# Altium project EX384.PrjPcb
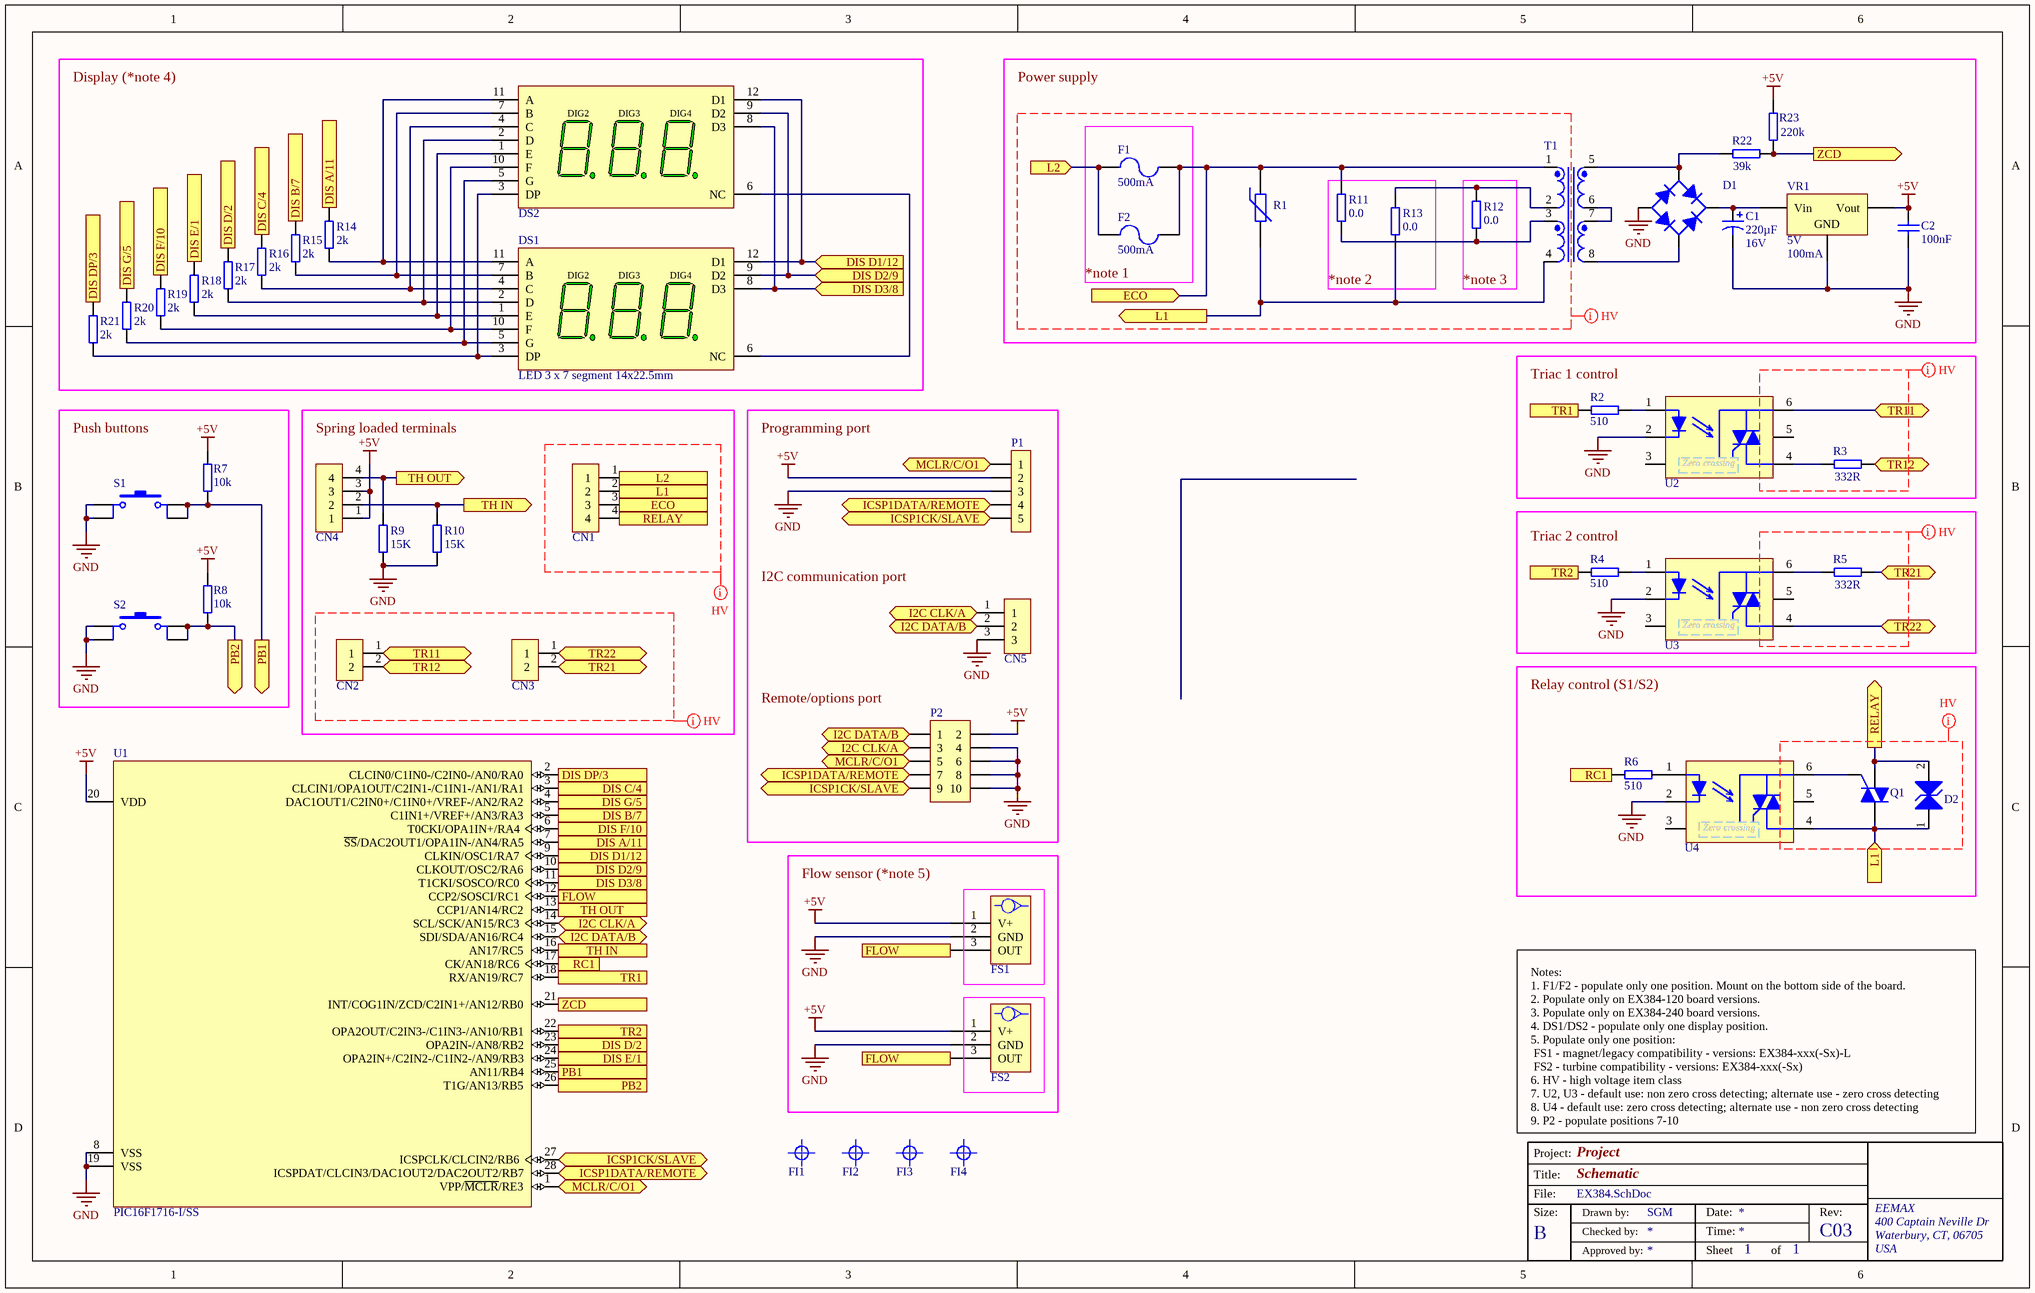
[diagram p0: EX384.SchDoc]
2 sheets, 53 parts. Net scope: flat (ports and power ports of the same name join across sheets).
Board files: EX384.PcbDoc, EX384Panel.PcbDoc
Sheets:
  EX384.SchDoc
  Sheet1.SchDoc

## Sheet EX384.SchDoc: Schematic
size B; CompanyName: EEMAX; DrawnBy: SGM; Organization: EEMAX/RHEEM; Address1: 400 Captain Neville Dr; Address2: Waterbury, CT, 06705; Address3: USA; Revision: C03; SheetNumber: 1; SheetTotal: 1; PageSetup: Record=PageOptions|CenterHorizontal=True|CenterVertical=True|PrintScale=1.00|XCorrection=1.00|YCorrection=1.00|PrintKind=1|BorderSize=5000000|LeftOffset=0|BottomOffset=0|Orientation=2|PaperLength=1000|PaperWidth=1000|Scale=100|PaperSource=7|PrintQuality=-3|MediaType=1|DitherType=10|PrintScaleMode=0|PaperKind=Ledger (11 x 17)|PaperIndex=3; ProjectName: Project

### Parts
C1  Capacitance: 220µF  Voltage Rating: 16V  [R6.3x7.7 SMD]  (hidden comment: CAP ALUM 220UF 20% 16V SMD)
C2  Capacitance: 100nF  [0805 C]  (hidden comment: CAP CER 100nF 25V NP0 0805)
CN1  TERM BLOCK PCB 4POS 3.5MM 300V 2A  [250A-4P (1212)]  (value not drawn)
CN2  TERM BLOCK PCB 2POS 3.5MM 300V 2A  [250A-2P (12)]  (value not drawn)
CN3  TERM BLOCK PCB 2POS 3.5MM 300V 2A  [250A-2P (12)]  (value not drawn)
CN4  TERM BLOCK PCB 4POS 3.5MM 300V 2A  [250A-4P (1212)]  (value not drawn)
CN5  3 Positions Header, Unshrouded Connector 0.100" (2.54mm) Through Hole Tin  [640456-3]  (value not drawn)
D1  IC BRIDGE DIODE 1A 600V 4SMD  [4 SMD]  (value not drawn)
D2  TVS DIODE 495VWM 760VC SMD  [DO-214AA (SMB)]  (value not drawn)
DS1  LED 3 x 7 segment 14x22.5mm  [LED3x7 - 10]
DS2  7-Segment LED Display, InfoVue, Red, 10 mA, 1.7 V, 6 mcd, 3, 7.1 mm  [LED3x7 - 7]  (value not drawn)
F1  Current Rating: 500mA  [FUSE X2]  (hidden comment: FUSE 500MA 250VAC 125VDC SMT)
F2  Current Rating: 500mA  [FUSE THRU]  (hidden comment: FUSE GLASS 500MA 350VAC 140VDC)
FI1  FIDUCIAL40  [FIDUCIAL40mil]  (value not drawn)  (no BOM)
FI2  FIDUCIAL40  [FIDUCIAL40mil]  (value not drawn)  (no BOM)
FI3  FIDUCIAL40  [FIDUCIAL40mil]  (value not drawn)  (no BOM)
FI4  FIDUCIAL40  [FIDUCIAL40mil]  (value not drawn)  (no BOM)
FS1  IC SW HALL EFFECT 3SIP TO92  [TO-92 - FS]  (value not drawn)
FS2  IC SW HALL EFFECT 3SIP TO92  [TO-92 - FS]  (value not drawn)
P1  Header, 5-Pin, .100 in spacing  [HDR1x5]  (value not drawn)
P2  Header, 2x5-Pin, .100 in spacing  [HDR2X5]  (value not drawn)
Q1  TRIAC SENS GATE 800V 1A SOT223  [SOT223]  (value not drawn)
R1  Varistor 150VAC 400A 3225  [3225 MOV]  (value not drawn)
R2  Resistance (Ohms): 510  [0805 C]  (hidden comment: RES SMD 510R 1% 1/8W 0805)
R3  Resistance (Ohms): 332R  [1206]  (hidden comment: RES SMD 332 OHM 1% 1/4W 1206)
R4  Resistance (Ohms): 510  [0805 C]  (hidden comment: RES SMD 510R 1% 1/8W 0805)
R5  Resistance (Ohms): 332R  [1206]  (hidden comment: RES SMD 332 OHM 1% 1/4W 1206)
R6  Resistance (Ohms): 510  [0805 C]  (hidden comment: RES SMD 510R 1% 1/8W 0805)
R7  Resistance (Ohms): 10k  [0805 C]  (hidden comment: RES SMD 10K OHM 1% 1/8W 0805)
R8  Resistance (Ohms): 10k  [0805 C]  (hidden comment: RES SMD 10K OHM 1% 1/8W 0805)
R9  Resistance (Ohms): 15K  [0805 C]  (hidden comment: RES SMD 15K OHM 1% 1/8W 0805)
R10  Resistance (Ohms): 15K  [0805 C]  (hidden comment: RES SMD 15K OHM 1% 1/8W 0805)
R11  Resistance (Ohms): 0.0  [1206]  (hidden comment: RES SMD 0.0 OHM JUMPER 1/4W 1206)
R12  Resistance (Ohms): 0.0  [1206]  (hidden comment: RES SMD 0.0 OHM JUMPER 1/4W 1206)
R13  Resistance (Ohms): 0.0  [1206]  (hidden comment: RES SMD 0.0 OHM JUMPER 1/4W 1206)
R14  Resistance (Ohms): 2k  [0805 C]  (hidden comment: RES SMD 2K OHM 1% 1/8W 0805)
R15  Resistance (Ohms): 2k  [0805 C]  (hidden comment: RES SMD 2K OHM 1% 1/8W 0805)
R16  Resistance (Ohms): 2k  [0805 C]  (hidden comment: RES SMD 2K OHM 1% 1/8W 0805)
R17  Resistance (Ohms): 2k  [0805 C]  (hidden comment: RES SMD 2K OHM 1% 1/8W 0805)
R18  Resistance (Ohms): 2k  [0805 C]  (hidden comment: RES SMD 2K OHM 1% 1/8W 0805)
R19  Resistance (Ohms): 2k  [0805 C]  (hidden comment: RES SMD 2K OHM 1% 1/8W 0805)
R20  Resistance (Ohms): 2k  [0805 C]  (hidden comment: RES SMD 2K OHM 1% 1/8W 0805)
R21  Resistance (Ohms): 2k  [0805 C]  (hidden comment: RES SMD 2K OHM 1% 1/8W 0805)
R22  Resistance (Ohms): 39k  [0805 C]  (hidden comment: RES SMD 39K OHM 1% 1/8W 0805)
R23  Resistance (Ohms): 220k  [0805 C]  (hidden comment: RES SMD 220K OHM 1% 1/8W 0805)
S1  SWITCH TACTILE NO SMT 0.05A 12VDC  [SW-PB]  (value not drawn)
S2  SWITCH TACTILE NO SMT 0.05A 12VDC  [SW-PB]  (value not drawn)
T1  FS10-110-C2  [FS10-110-C2]  (value not drawn)
U1  PIC16F1716-I/SS  [SSOP-SS28_L]
U2  OPTOISOLATOR TRIAC 6SMD  [6-SMD]  (value not drawn)
U3  OPTOISOLATOR TRIAC 6SMD  [6-SMD]  (value not drawn)
U4  OPTOISOLATOR TRIAC 6SMD  [6-SMD]  (value not drawn)
VR1  IOut: 100mA  VOut: 5V  [SOT89-3]  (hidden comment: IC REG LDO 5V 0.1A SOT89-3)

### Blocks framed on the sheet
Display (*note 4): DS1 DS2 R14-R21
Power supply: C1 C2 D1 R1 R22 R23 T1 VR1
*note 1: F1 F2
*note 2: R11 R13
*note 3: R12
Triac 1 control: R2 R3 U2
Push buttons: R7 R8 S1 S2
Spring loaded terminals: CN1-CN4 R9 R10
Triac 2 control: R4 R5 U3
Relay control (S1/S2): D2 Q1 R6 U4
Flow sensor (*note 5): FS1 FS2

### Ports
DIS A/11 (in), DIS A/11 (out), DIS B/7 (in), DIS B/7 (out), DIS C/4 (in), DIS C/4 (out), DIS D1/12 (in), DIS D1/12 (out), DIS D2/9 (in), DIS D2/9 (out), DIS D3/8 (in), DIS D3/8 (out), DIS D/2 (in), DIS D/2 (out), DIS DP/3 (in), DIS DP/3 (out), DIS E/1 (in), DIS E/1 (out), DIS F/10 (in), DIS F/10 (out), DIS G/5 (in), DIS G/5 (out), ECO (in), ECO (out), FLOW (in), FLOW (out), I2C CLK/A (bidir), I2C DATA/B (bidir), ICSP1CK/SLAVE (bidir), ICSP1DATA/REMOTE (bidir), L1 (in), L1 (out), L2 (in), L2 (out), MCLR/C/O1 (bidir), PB1 (in), PB1 (out), PB2 (in), PB2 (out), RC1 (in), RC1 (out), RELAY (in), RELAY (out), TH IN (in), TH IN (out), TH OUT (in), TH OUT (out), TR1 (in), TR1 (out), TR2 (in), TR2 (out), TR11 (bidir), TR12 (bidir), TR21 (bidir), TR22 (bidir), ZCD (in), ZCD (out)

### Nets
+5V: C2.2 CN4.1 CN4.3 FS1.1(V+) FS2.1(V+) P1.2 P2.2 R7.1 R8.1 R23.2 U1.20(VDD) VR1.1(Vout)
GND: C1.2 C2.1 CN5.3 D1.2(A) FS1.2(GND) FS2.2(GND) P1.3 P2.4 P2.6 P2.8 P2.10 R9.2 R10.2 S1.3 S1.4 S2.1 S2.2 U1.8(VSS) U1.19(VSS) U2.2 U3.2 U4.2 VR1.2(GND)
NetC1_1: C1.1 D1.1(K) VR1.3(Vin)
NetCN1_1: CN1.1 F1.1 F2.1 ; port L2
NetCN1_2: CN1.2 D2.1(A) Q1.2(A2) R1.2 R13.1 T1.4(Pri2-) U4.4 ; port L1
NetCN1_3: CN1.3 F1.2 F2.2 R1.1 R11.2 T1.1(Pri1+) ; port ECO
NetCN1_4: CN1.4 D2.2(K) Q1.1(A1) ; port RELAY
NetCN2_1: CN2.1 U2.6 ; port TR11
NetCN2_2: CN2.2 R3.2 ; port TR12
NetCN3_1: CN3.1 U3.4 ; port TR22
NetCN3_2: CN3.2 R5.2 ; port TR21
NetCN4_2: CN4.2 R10.1 U1.16(AN17/RC5) ; port TH IN
NetCN4_4: CN4.4 R9.1 U1.13(CCP1/AN14/RC2) ; port TH OUT
NetCN5_1: CN5.1 P2.3 U1.14(SCL/SCK/AN15/RC3) ; port I2C CLK/A
NetCN5_2: CN5.2 P2.1 U1.15(SDI/SDA/AN16/RC4) ; port I2C DATA/B
NetD1_3: D1.3(C) R22.1 T1.5(Sec1+)
NetD1_4: D1.4(C) T1.8(Sec2-)
NetDS1_1: DS1.1(E) DS2.1(E) R18.1
NetDS1_2: DS1.2(D) DS2.2(D) R17.1
NetDS1_3: DS1.3(DP) DS2.3(DP) R21.1
NetDS1_4: DS1.4(C) DS2.4(C) R16.1
NetDS1_5: DS1.5(G) DS2.5(G) R20.1
NetDS1_6: DS1.6(NC) DS2.6(NC)
NetDS1_7: DS1.7(B) DS2.7(B) R15.1
NetDS1_8: DS1.8(D3) DS2.8(D3) U1.11(T1CKI/SOSCO/RC0) ; port DIS D3/8
NetDS1_9: DS1.9(D2) DS2.9(D2) U1.10(CLKOUT/OSC2/RA6) ; port DIS D2/9
NetDS1_10: DS1.10(F) DS2.10(F) R19.1
NetDS1_11: DS1.11(A) DS2.11(A) R14.1
NetDS1_12: DS1.12(D1) DS2.12(D1) U1.9(CLKIN/OSC1/RA7) ; port DIS D1/12
NetFS1_3: FS1.3(OUT) FS2.3(OUT) U1.12(CCP2/SOSCI/RC1) ; port FLOW
NetP1_1: P1.1 P2.5 U1.1(VPP/~{MCLR}/RE3) ; port MCLR/C/O1
NetP1_4: P1.4 P2.7 U1.28(ICSPDAT/CLCIN3/DAC1OUT2/DAC2OUT2/RB7) ; port ICSP1DATA/REMOTE
NetP1_5: P1.5 P2.9 U1.27(ICSPCLK/CLCIN2/RB6) ; port ICSP1CK/SLAVE
NetQ1_3: Q1.3(G) U4.6
NetR2_1: R2.1 U1.18(RX/AN19/RC7) ; port TR1
NetR2_2: R2.2 U2.1
NetR3_1: R3.1 U2.4
NetR4_1: R4.1 U1.22(OPA2OUT/C2IN3-/C1IN3-/AN10/RB1) ; port TR2
NetR4_2: R4.2 U3.1
NetR5_1: R5.1 U3.6
NetR6_1: R6.1 U1.17(CK/AN18/RC6) ; port RC1
NetR6_2: R6.2 U4.1
NetR7_2: R7.2 S1.1 S1.2 U1.25(AN11/RB4) ; port PB1
NetR8_2: R8.2 S2.3 S2.4 U1.26(T1G/AN13/RB5) ; port PB2
NetR11_1: R11.1 R12.1 T1.3(Pri2+)
NetR12_2: R12.2 R13.2 T1.2(Pri1-)
NetR14_2: R14.2 U1.7(~{SS}/DAC2OUT1/OPA1IN-/AN4/RA5) ; port DIS A/11
NetR15_2: R15.2 U1.5(C1IN1+/VREF+/AN3/RA3) ; port DIS B/7
NetR16_2: R16.2 U1.3(CLCIN1/OPA1OUT/C2IN1-/C1IN1-/AN1/RA1) ; port DIS C/4
NetR17_2: R17.2 U1.23(OPA2IN-/AN8/RB2) ; port DIS D/2
NetR18_2: R18.2 U1.24(OPA2IN+/C2IN2-/C1IN2-/AN9/RB3) ; port DIS E/1
NetR19_2: R19.2 U1.6(T0CKI/OPA1IN+/RA4) ; port DIS F/10
NetR20_2: R20.2 U1.4(DAC1OUT1/C2IN0+/C1IN0+/VREF-/AN2/RA2) ; port DIS G/5
NetR21_2: R21.2 U1.2(CLCIN0/C1IN0-/C2IN0-/AN0/RA0) ; port DIS DP/3
NetR22_2: R22.2 R23.1 U1.21(INT/COG1IN/ZCD/C2IN1+/AN12/RB0) ; port ZCD
NetT1_6: T1.6(Sec1-) T1.7(Sec2+)

Not connected (* = marked no-connect by the designer): U2 3 5; U3 3 5; U4 3 5

### Layout directives
net class 300Volts: (no net found under the mark)

### Notes on the sheet
- Programming port
- I2C communication port
- (near P2) Remote/options port
- Notes:
  1. F1/F2 - populate only one position. Mount on the bottom side of the board.
  2. Populate only on EX384-120 board versions.
  3. Populate only on EX384-240 board versions.
  4. DS1/DS2 - populate only one display position.
  5. Populate only one position:
  FS1 - magnet/legacy compatibility - versions: EX384-xxx(-Sx)-L
  FS2 - turbine compatibility - versions: EX384-xxx(-Sx)
  6. HV - high voltage item class
  7. U2, U3 - default use: non zero cross detecting; alternate use - zero cross detecting
  8. U4 - default use: zero cross detecting; alternate use - non zero cross detecting
  9. P2 - populate positions 7-10
- Title:
- Project:
- Size:
- File:
- B
- Drawn by:
- Checked by:
- Date:
- Time:
- Rev:
- EEMAX
- 400 Captain Neville Dr
- Waterbury, CT, 06705
- Approved by:
- Sheet
- of
- USA
- (in symbol DISLED3x7S10x22.5MM) DIG2; DIG3; DIG4
- (in symbol DISLED3x7S14x22.5MM) DIG2; DIG3; DIG4
- (in symbol OPTO6SMD) Zero crossing

### Library data of the parts
C1 = CAPEL220UF20%16VSMDG: Manufacturer: Generic; Lifetime @ Temp.: 1000 Hrs @ 105°C; Ripple Current: 105mA; Surface Mount Land Size: 0.260" L x 0.260" W (6.60mm x 6.60mm); RoHS: RoHS Compliant; Category: Capacitors; Packaging: Tape & Reel (TR); Tolerance: ±20%; Operating Temperature: -55°C ~ 105°C; Package / Case: Radial, Can - SMD; Applications: General Purpose; Mounting Type: Surface Mount
C2 = CAPCER100NF10%25V0805G: Manufacturer: Generic; Tolerance: ±10%; Temperature Coefficient: C0G, NP0; Value: 100nF; RoHS: RoHS Compliant; Category: Capacitors; Voltage - Rated: 25V; Mounting Type: Surface Mount, MLCC; Operating Temperature: -55°C ~ 125°C; Applications: General Purpose; Package / Case: 0805 (2012 Metric)
CN1 CN4 = CONNTB4POS300V2A: Number of Levels: 1; Positions Per Level: 4; Pitch: 0.138" (3.50mm); Mating Orientation: 45° (135°) Angle with Board; Wire Gauge: 16-24 AWG; Wire Termination: Screwless - Spring Cage, Tension Clamp; RoHS: RoHS Compliant; Category: Connectors, Interconnects; Mounting Type: Through Hole; Voltage: 300V
CN2 CN3 = CONNTB2POS300V2A: Number of Levels: 1; Positions Per Level: 2; Pitch: 0.138" (3.50mm); Mating Orientation: 45° (135°) Angle with Board; Wire Gauge: 16-24 AWG; Wire Termination: Screwless - Spring Cage, Tension Clamp; RoHS: RoHS Compliant; Category: Connectors, Interconnects; Packaging: Bulk; Mounting Type: Through Hole
CN5 = CONNMTA1003POS: Manufacturer: TE Connectivity AMP Connectors; Number of Positions: 3; Number of Positions Loaded: All; Manufacturer Part Number: 640456-3; RoHS: RoHS Compliant; Category: Connectors, Interconnects; Pricing 1: 1=0.13, 10=0.119, 100=0.095, 500=0.088, 1000=0.081, 2000=0.075, 5000=0.07, 10000=0.056, 25000=0.052 (USD); Packaging: Bulk; Part Status: Active; Contact Type: Male Pin; Connector Type: Header, Unshrouded; Pitch: 0.100" (2.54mm); Number of Rows: 1; Row Spacing: -; Contact Mating Length: 0.295" (7.49mm); Mounting Type: Through Hole; Termination: Solder; Fastening Type: Friction Lock; Features: -; Contact Finish: Tin; Contact Finish Thickness: -; Color: Natural; ComponentLink1URL: http://www.te.com/commerce/DocumentDelivery/DDEController?Action=srchrtrv&DocNm=640456&DocType=Customer+Drawing&DocLang=English; ComponentLink1Description: http://www.te.com/commerce/DocumentDelivery/DDEController?Action=srchrtrv&DocNm=640456&DocType=Customer+Drawing&DocLang=English
D1 = BRIDGE1A600V4SMD: Diode Type: Single Phase; RoHS: RoHS Compliant; Category: Discrete Semiconductor Products; Packaging: Tape & Reel (TR); Voltage - Peak Reverse (Max): 600V; Current - DC Forward (If) (Max): 1A; Mounting Type: Surface Mount; Package / Case: 4-SMD, Gull Wing
D2 = TVS495VWM800MA600WSMD: Type: Zener; Bidirectional Channels: 1; Voltage - Reverse Standoff (Typ): 495V; Voltage - Breakdown (Min): 522.5V; Voltage - Clamping (Max) @ Ipp: 760V; Current - Peak Pulse (10/1000µs): 800mA; Power - Peak Pulse: 600W; Power Line Protection: No; RoHS: RoHS Compliant; Category: Circuit Protection; Mounting Type: Surface Mount; Unidirectional Channels: -; Applications: General Purpose; Capacitance @ Frequency: -; Operating Temperature: -55°C ~ 150°C (TJ); Package / Case: DO-214AA, SMB; Supplier Device Package: DO-214AA (SMB)
DS1 = DISLED3x7S14x22.5MM
DS2 = DISLED3x7S10x22.5MM: Character Size: 7.1; Common Connection: Common Anode; Forward Current If: 10; Forward Voltage: 1.7; Luminous Intensity: 6; No. of Digits / Alpha: 3; LED Color: Red; Packaging: Each; Product Range: -; RoHS: YES
F1 = FUSE500MA250VACSM: Fuse Type: Cartridge, Glass; Voltage Rating - AC: 250V; Voltage Rating - DC: 125V; Response Time: Fast; Breaking Capacity @ Rated Voltage: 50A; Melting I²t: 0.0415; Approvals: CE, CSA, cURus; DC Cold Resistance: 1.2 Ohm; RoHS: RoHS Compliant; Category: Circuit Protection; Package / Case: 2-SMD, Square End Block; Mounting Type: Through Hole; Operating Temperature: -55°C ~ 125°C; Size / Dimension: 0.405" L x 0.109" W x 0.109" H (10.29mm x 2.77mm x 2.77mm)
F2 = FUSE500MA350VACTH: Fuse Type: Cartridge, Glass; Voltage Rating - AC: 350V; Voltage Rating - DC: 140V; Response Time: Fast; Breaking Capacity @ Rated Voltage: 100A AC, 150A DC; Melting I²t: 0.1; Approvals: CE, CSA, cURus; DC Cold Resistance: 0.33 Ohm; RoHS: RoHS Compliant; Category: Circuit Protection; Package / Case: 2AG, 5mm x 15mm (Axial); Mounting Type: Through Hole; Operating Temperature: -55°C ~ 125°C; Size / Dimension: 0.217" Dia x 0.591" L (5.50mm x 15.00mm)
FS1 FS2 = HALL5.5MTTO92: Function: Latch; Sensing Range: 5.5mT Trip, -5.5mT Release; Test Condition: -40°C ~ 125°C; Voltage - Supply: 3 V ~ 24 V; Current - Supply (Max): 6mA; Current - Output (Max): 20mA; Output Type: Open Collector; RoHS: RoHS Compliant; Category: Sensors, Transducers; Packaging: Bulk; Technology: Hall Effect; Features: Temperature Compensated; Operating Temperature: -40°C ~ 125°C (TA); Package / Case: TO-226-3, TO-92-3 (TO-226AA)
P1 = H5S100G: Manufacturer: Generic; LatestRevisionDate: 17-Jul-2002; LatestRevisionNote: Re-released for DXP Platform.; Publisher: Altium Limited
P2 = H5x2S100G: Manufacturer: Generic; LatestRevisionDate: 17-Jul-2002; LatestRevisionNote: Re-released for DXP Platform.; Publisher: Altium Limited
Q1 = TRIAC800V1ASOT223: Triac Type: Logic - Sensitive Gate; Voltage - Gate Trigger (Vgt) (Max): 1.3V; Current - Non Rep. Surge 50, 60Hz (Itsm): 16A; Current - Gate Trigger (Igt) (Max): 7mA; Current - Hold (Ih) (Max): 10mA; Configuration: Single; RoHS: RoHS Compliant; Category: Discrete Semiconductor Products; Voltage - Off State: 800V; Current - On State (It (RMS)) (Max): 1A; Mounting Type: Surface Mount; Package / Case: SOT223; Supplier Device Package: SOT223
R1 = MOV150VAC400A3225: Manufacturer: Thinking Electronics; Manufacturer Part Number: MVS3225P241; Varistor Voltage (V @ 1mA DC): 240; Voltage Continuous Max (VAC/VDC): 150/200; Voltage Clamping Max (V @ 5A @ 8/20 us): 395; Surge Current Max (A @ 8/20 us): 400; Energy Max (J @ 10/1000 us): 9; Power Rating (W): 0.1; Reference Capacitance (pF): 90
R2 R4 R6 = R510R1%0805G: Manufacturer: Generic; Power (Watts): 0.125W, 1/8W; Temperature Coefficient: ±100ppm/°C; RoHS: RoHS Compliant; Category: Resistors; Tolerance: ±1%; Composition: Thick Film; Operating Temperature: -55°C ~ 155°C; Package / Case: 0805 (2012 Metric); Supplier Device Package: 0805; Size / Dimension: 0.079" L x 0.049" W (2.00mm x 1.25mm); Height: 0.028" (0.70mm); Number of Terminations: 2
R3 R5 = R332R1%1206G: Manufacturer: Generic; Power (Watts): 0.25W, 1/4W; Temperature Coefficient: ±100ppm/°C; RoHS: RoHS Compliant; Category: Resistors; Tolerance: ±1%; Composition: Thick Film; Operating Temperature: -55°C ~ 155°C; Package / Case: 1206 (3216 Metric); Supplier Device Package: 1206 (3216 Metric); Size / Dimension: 0.126" L x 0.063" W (3.20mm x 1.60mm); Height: 0.024" (0.60mm); Number of Terminations: 2
R7 R8 = R010K1%0805G: Manufacturer: Generic; Power (Watts): 0.125W, 1/8W; Temperature Coefficient: ±100ppm/°C; RoHS: RoHS Compliant; Category: Resistors; Tolerance: ±1%; Composition: Thick Film; Features: Moisture Resistant; Operating Temperature: -55°C ~ 155°C; Supplier Device Package: 0805; Size / Dimension: 0.079" L x 0.049" W (2.00mm x 1.25mm); Height: 0.024" (0.60mm); Number of Terminations: 2; Package / Case: 0805 (2012 Metric)
R9 R10 = R015K1%0805G: Manufacturer: Generic; Power (Watts): 0.125W, 1/8W; Temperature Coefficient: ±100ppm/°C; RoHS: RoHS Compliant; Category: Resistors; Tolerance: ±1%; Composition: Thick Film; Features: Moisture Resistant; Operating Temperature: -55°C ~ 155°C; Package / Case: 0805 (2012 Metric); Size / Dimension: 0.079" L x 0.049" W (2.00mm x 1.25mm); Number of Terminations: 2; Supplier Device Package: 0805; Value: 15K
R11-R13 = R000R0%1206G: Manufacturer: Generic; Power (Watts): 0.25W, 1/4W; RoHS: RoHS Compliant; Category: Resistors; Tolerance: Jumper; Composition: Thick Film; Features: Moisture Resistant; Temperature Coefficient: -; Operating Temperature: -55°C ~ 155°C; Package / Case: 1206 (3216 Metric); Supplier Device Package: 1206; Size / Dimension: 0.122" L x 0.063" W (3.10mm x 1.60mm); Height: 0.026" (0.65mm); Number of Terminations: 2
R14-R21 = R002K1%0805G: Manufacturer: Generic; Power (Watts): 0.125W, 1/8W; Temperature Coefficient: ±100ppm/°C; RoHS: RoHS Compliant; Category: Resistors; Tolerance: ±1%; Composition: Thick Film; Features: Moisture Resistant; Operating Temperature: -55°C ~ 155°C; Package / Case: 0805 (2012 Metric); Supplier Device Package: 0805; Size / Dimension: 0.079" L x 0.049" W (2.00mm x 1.25mm); Number of Terminations: 2; Height: 0.024" (0.60mm)
R22 = R039K1%0805G: Manufacturer: Generic; Power (Watts): 0.125W, 1/8W; Temperature Coefficient: ±100ppm/°C; RoHS: RoHS Compliant; Category: Resistors; Tolerance: ±1%; Composition: Thick Film; Features: Moisture Resistant; Operating Temperature: -55°C ~ 155°C; Package / Case: 0805 (2012 Metric); Supplier Device Package: 0805; Size / Dimension: 0.079" L x 0.049" W (2.00mm x 1.25mm); Height - Seated (Max): 0.024" (0.60mm); Number of Terminations: 2
R23 = R220K1%0805G: Manufacturer: Generic; Power (Watts): 0.125W, 1/8W; Temperature Coefficient: ±100ppm/°C; RoHS: RoHS Compliant; Category: Resistors; Tolerance: ±1%; Composition: Thick Film; Features: Moisture Resistant; Operating Temperature: -55°C ~ 155°C; Package / Case: 0805 (2012 Metric); Supplier Device Package: 0805; Size / Dimension: 0.079" L x 0.049" W (2.00mm x 1.25mm); Height - Seated (Max): 0.024" (0.60mm); Number of Terminations: 2
S1 S2 = SWSMT5MM005A12VDC: Contact Rating @ Voltage: 0.05A @ 24VDC; Actuator Height off PCB, from Pins: 5.00mm; Outline: 6.00mm x 6.00mm; Switch Travel: 0.25mm
T1 = FS10-110-C2: XFRMR LAMINATED 1.1VA THRU HOLE; Manufacturer: Triad Magnetics; Manufacturer Part Number: FS10-110-C2-B; Type: Laminated Core; Voltage - Primary: 115V, 230V; Voltage - Secondary (Full Load): Parallel 5V, Series 10V; Current - Output (Max): Parallel 220mA, Series 110mA; Primary Winding(s): Dual; Center Tap: No; Voltage - Isolation: 4200Vrms; Supplier 1: Digi-Key; RoHS: RoHS Compliant; Category: Transformers; Stock 1: 801; Pricing 1: 1=4.69, 10=3.798, 25=3.0704, 50=2.8764, 100=2.7472, 250=2.6664, 500=2.5856, 1000=2.5048, 5000=2.3028 (USD); Secondary Winding(s): Dual; Power - Max: 1.1 VA; Mounting Type: Through Hole; Termination Style: PC Pin; Size / Dimension: 34.93mm L x 28.58mm W; Height - Seated (Max): 23.80mm; ComponentLink1URL: http://catalog.triadmagnetics.com/Asset/FS10-110-C2.pdf; ComponentLink1Description: http://catalog.triadmagnetics.com/Asset/FS10-110-C2.pdf; Supplier Part Number 1: 237-1578-ND
U1 = PIC16F1716-I/SS: IC MCU 8BIT 14KB FLASH 28SSOP; Manufacturer: Microchip Technology; Manufacturer Part Number: PIC16F1716T-I/SS; Core Processor: PIC; Core Size: 8-Bit; Speed: 32MHz; Connectivity: I²C, LIN, SPI, UART/USART; Peripherals: Brown-out Detect/Reset, POR, PWM, WDT; Number of I/O: 25; Program Memory Size: 14KB (8K x 14); RAM Size: 1K x 8; Voltage - Supply (Vcc/Vdd): 2.3 V ~ 5.5 V; Data Converters: A/D 17x10b, D/A 1x5b, 1x8b; Oscillator Type: Internal; Supplier 1: Digi-Key; RoHS: RoHS Compliant; Category: Integrated Circuits (ICs); Stock 1: 0; Pricing 1: 2100=1.14 (USD); Packaging: Tape & Reel (TR); Program Memory Type: FLASH; EEPROM Size: -; Operating Temperature: -40°C ~ 85°C (TA); Package / Case: 28-SSOP (0.209", 5.30mm Width); Supplier Device Package: 28-SSOP; ComponentLink1URL: http://www.microchip.com/mymicrochip/filehandler.aspx?ddocname=en566662; ComponentLink1Description: http://www.microchip.com/mymicrochip/filehandler.aspx?ddocname=en566662; Supplier Part Number 1: PIC16F1716T-I/SS-ND
U2-U4 = OPTO6SMD: Number of Channels: 1; Voltage - Off State: 600V; Static dV/dt (Min): 600V/µs; Current - LED Trigger (Ift) (Max): 5mA; Current - Hold (Ih): 500µA (Typ); Current - DC Forward (If) (Max): 60mA; RoHS: RoHS Compliant; Output Type: Triac; Current - On State (It (RMS)) (Max): -; Turn On Time: -; Operating Temperature: -40°C ~ 85°C; Mounting Type: Surface Mount; Package / Case: 6-SMD, Gull Wing
VR1 = VREG78L05V100MA: Regulator Topology: Positive Fixed; Voltage - Dropout (Typical): 1.7V @ 40mA; Number of Regulators: 1; Voltage - Input: Up to 30V; RoHS: RoHS Compliant; Category: Integrated Circuits (ICs); Voltage - Output: 5V; Current - Output: 100mA; Current - Limit (Min): -; Operating Temperature: 0°C ~ 125°C; Mounting Type: Surface Mount; Package / Case: TO-243AA; Supplier Device Package: SOT-89-3

## Sheet Sheet1.SchDoc
size A

## Assembly variants
EX384-C2-P: not fitted DS2 F1 FS1 FS2 R1 R11 R12 R13 T1
EX384-120: not fitted DS2 F1 FS1 P1 P2 R12
EX384-240: not fitted DS2 F1 FS1 P1 P2 R11 R13; alternate parts R1 -> MOV275VAC400A3225
EX384-240-L: not fitted DS2 F1 FS2 P1 P2 R11 R13; alternate parts R1 -> MOV275VAC400A3225
EX384-277: not fitted DS2 F1 FS1 P1 P2 R11 R12 R13; alternate parts R1 -> MOV300VAC400A3225, T1 -> AMXC-452
EX384-277-L: not fitted DS2 F1 FS2 P1 P2 R11 R12 R13; alternate parts R1 -> MOV300VAC400A3225, T1 -> AMXC-452
EX384-183: not fitted CN3 CN4 CN5 D2 DS1 DS2 P1 P2 Q1 R1 R4 R5 R6 R7 R8 R9 R10 R14 R15 R16 R17 R18 R19 R20 R21 S1 S2 U1 U3 U4
EX384-183-diff: not fitted C1 C2 CN1 CN2 D1 F2 R2 R3 R11 R12 R13 T1 U2 VR1